# EAGLE design main_stm (EAGLE 9.6.2)
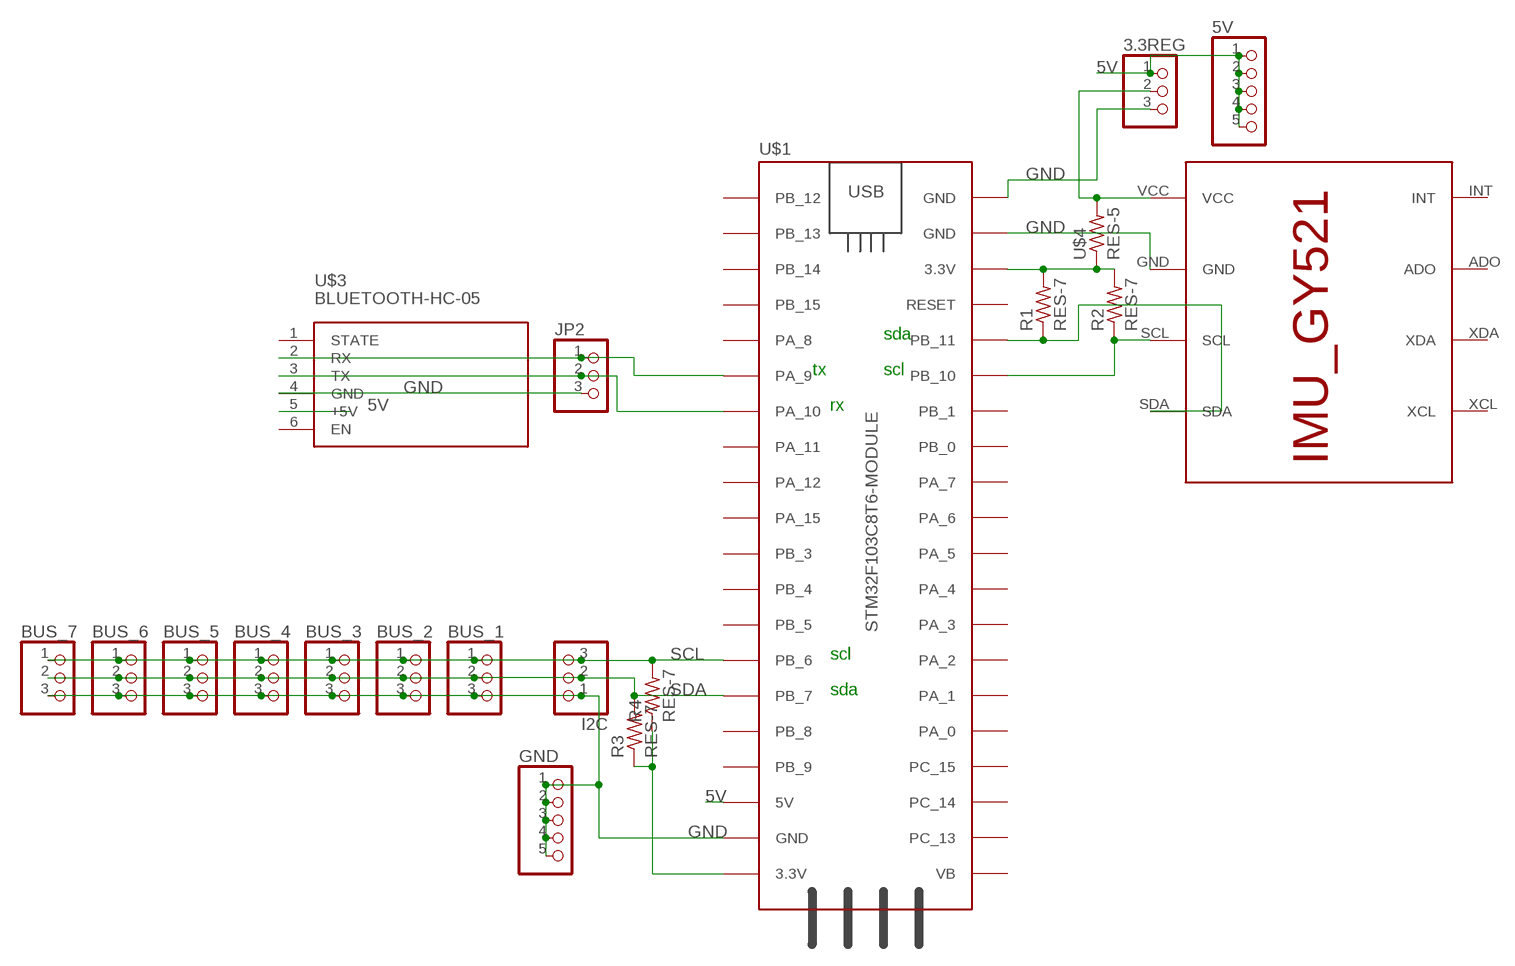
[diagram p0: schematic, sheet 1]

## Parts
3.3REG  PINHD-1X3  [1X03]
5V  PINHD-1X5  [1X05]
BUS_1  PINHD-1X3  [1X03]
BUS_2  PINHD-1X3  [1X03]
BUS_3  PINHD-1X3  [1X03]
BUS_4  PINHD-1X3  [1X03]
BUS_5  PINHD-1X3  [1X03]
BUS_6  PINHD-1X3  [1X03]
BUS_7  PINHD-1X3  [1X03]
GND  PINHD-1X5  [1X05]
I2C  PINHD-1X3  [1X03]
JP2  PINHD-1X3  [1X03]
R1  RES-7  [0204/7]
R2  RES-7  [0204/7]
R3  RES-7  [0204/7]
R4  RES-7  [0204/7]
U$1  STM32F103C8T6-MODULE  [STM32F103C8T6-MODULE]
U$2  IMU_ROBOCON_GY521  [IMU_GY521]
U$3  BLUETOOTH-HC-05  [WIRELESS-BLUETOOTH-HC-05]
U$4  RES-5  [0204/5]

## Nets
5V: 3.3REG.1 5V.1 5V.2 5V.3 5V.4 5V.5 U$1.5V U$3.5(+5V)
GND: 3.3REG.3 BUS_1.3 BUS_2.3 BUS_3.3 BUS_4.3 BUS_5.3 BUS_6.3 BUS_7.3 GND.1 GND.2 GND.3 GND.4 GND.5 I2C.1 JP2.3 U$1.GND_1(GND) U$1.GND_2(GND) U$1.GND_3(GND) U$2.GND U$3.4(GND)
N$1: R1.1 U$1.PB_11 U$2.SDA
N$2: R2.1 U$1.PB_10 U$2.SCL
N$3: R1.2 R2.2 U$1.3.3V_2(3.3V) U$4.1
N$5: 3.3REG.2 U$2.VCC U$4.2
N$8: R3.1 R4.1 U$1.3.3V_1(3.3V)
N$10: JP2.1 U$1.PA_9 U$3.2(RX)
N$12: JP2.2 U$1.PA_10 U$3.3(TX)
SCL: BUS_1.1 BUS_2.1 BUS_3.1 BUS_4.1 BUS_5.1 BUS_6.1 BUS_7.1 I2C.3 R4.2 U$1.PB_6
SDA: BUS_1.2 BUS_2.2 BUS_3.2 BUS_4.2 BUS_5.2 BUS_6.2 BUS_7.2 I2C.2 R3.2 U$1.PB_7
Unconnected: U$1.PA_0 U$1.PA_1 U$1.PA_2 U$1.PA_3 U$1.PA_4 U$1.PA_5 U$1.PA_6 U$1.PA_7 U$1.PA_8 U$1.PA_11 U$1.PA_12 U$1.PA_15 U$1.PB_0 U$1.PB_1 U$1.PB_3 U$1.PB_4 U$1.PB_5 U$1.PB_8 U$1.PB_9 U$1.PB_12 U$1.PB_13 U$1.PB_14 U$1.PB_15 U$1.PC_13 U$1.PC_14 U$1.PC_15 U$1.RESET U$1.VB U$2.ADO U$2.INT U$2.XCL U$2.XDA U$3.1(STATE) U$3.6(EN)

## Notes on the sheet
- sda
- tx | scl
- rx
- scl
- sda

## Library data of the parts
3.3REG BUS_1-BUS_7 I2C JP2 = MIA_LIBRARY-2-2-2:PINHD-1X3: PIN HEADER
5V GND = MIA_LIBRARY-2-2-2:PINHD-1X5: PIN HEADER
R1-R4 = MIA_LIBRARY-2-2-2:RES-7
U$1 = MIA_LIBRARY-2-2-2:STM32F103C8T6-MODULE: STM32F103C8T6 module with ARM Cortex-3, 20kB SRAM, 64kB Flash, 72MHz
U$2 = MIA_LIBRARY-2-2-2:IMU_ROBOCON_GY521
U$3 = MIA_LIBRARY-2-2-2:BLUETOOTH-HC-05: Bluetooth Transceiver Module based on HC-05 board Tutorial is available here: https://arduino-info.wikispaces.com/BlueTooth-HC05-HC06-Modules-How-To Click here to find device on ebay.com <http://www.ebay.com/sch/hc-05+module+rs232>
U$4 = MIA_LIBRARY-2-2-2:RES-5

## Board
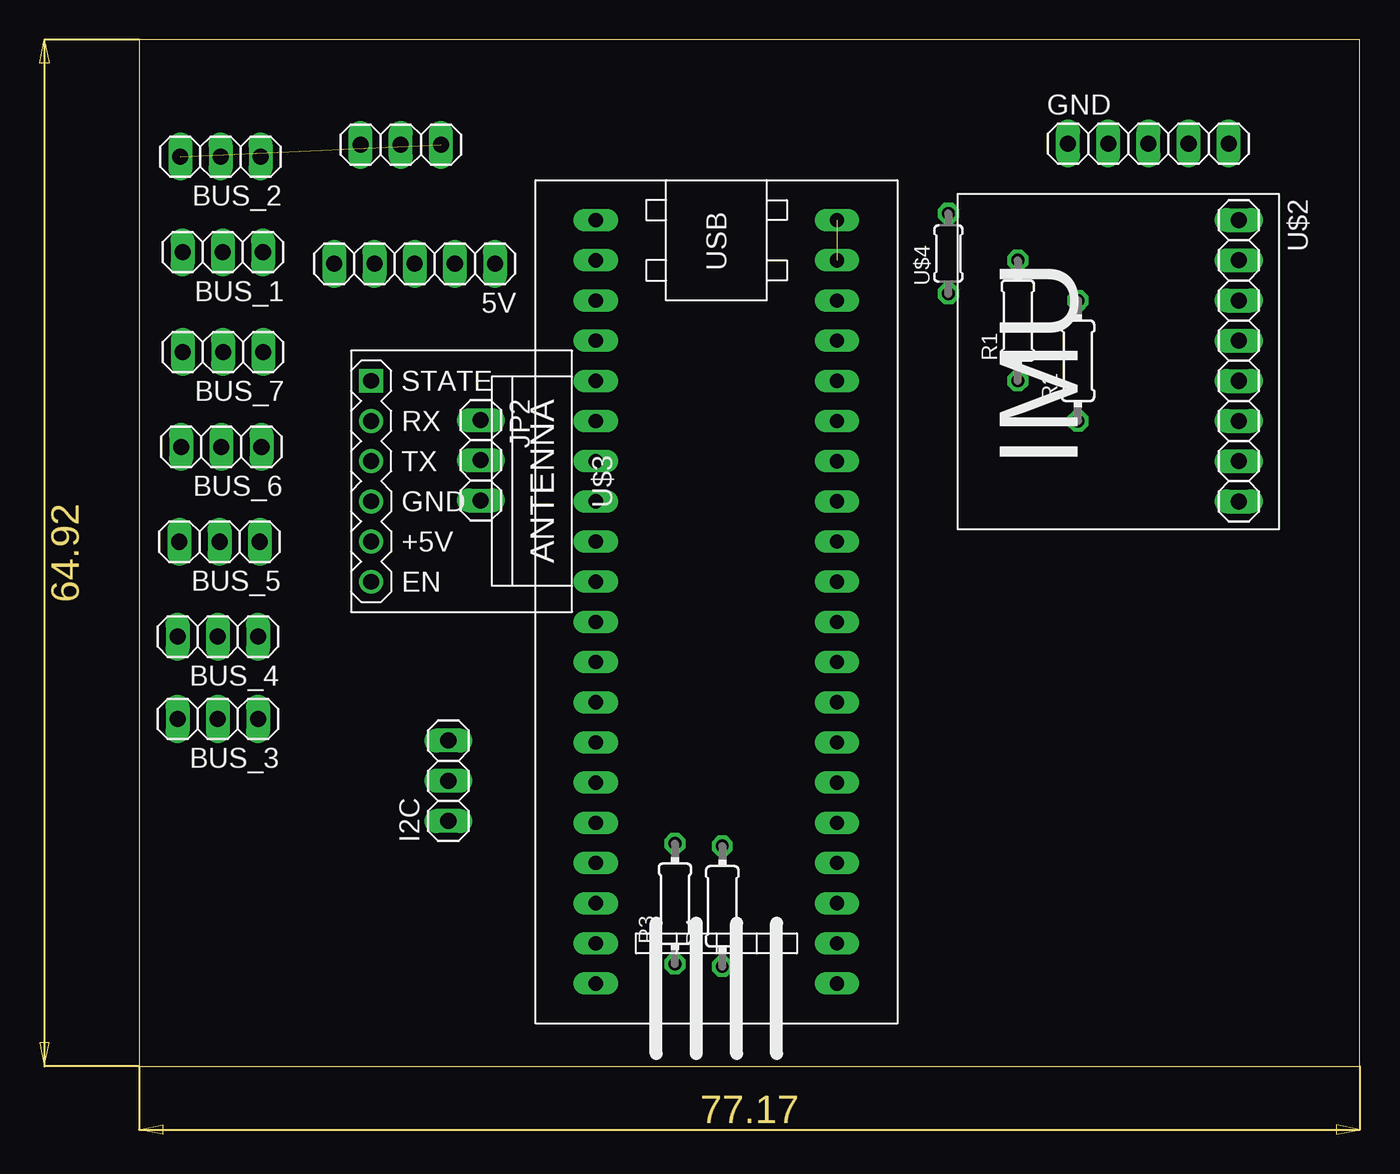
[diagram p1: board, top side]
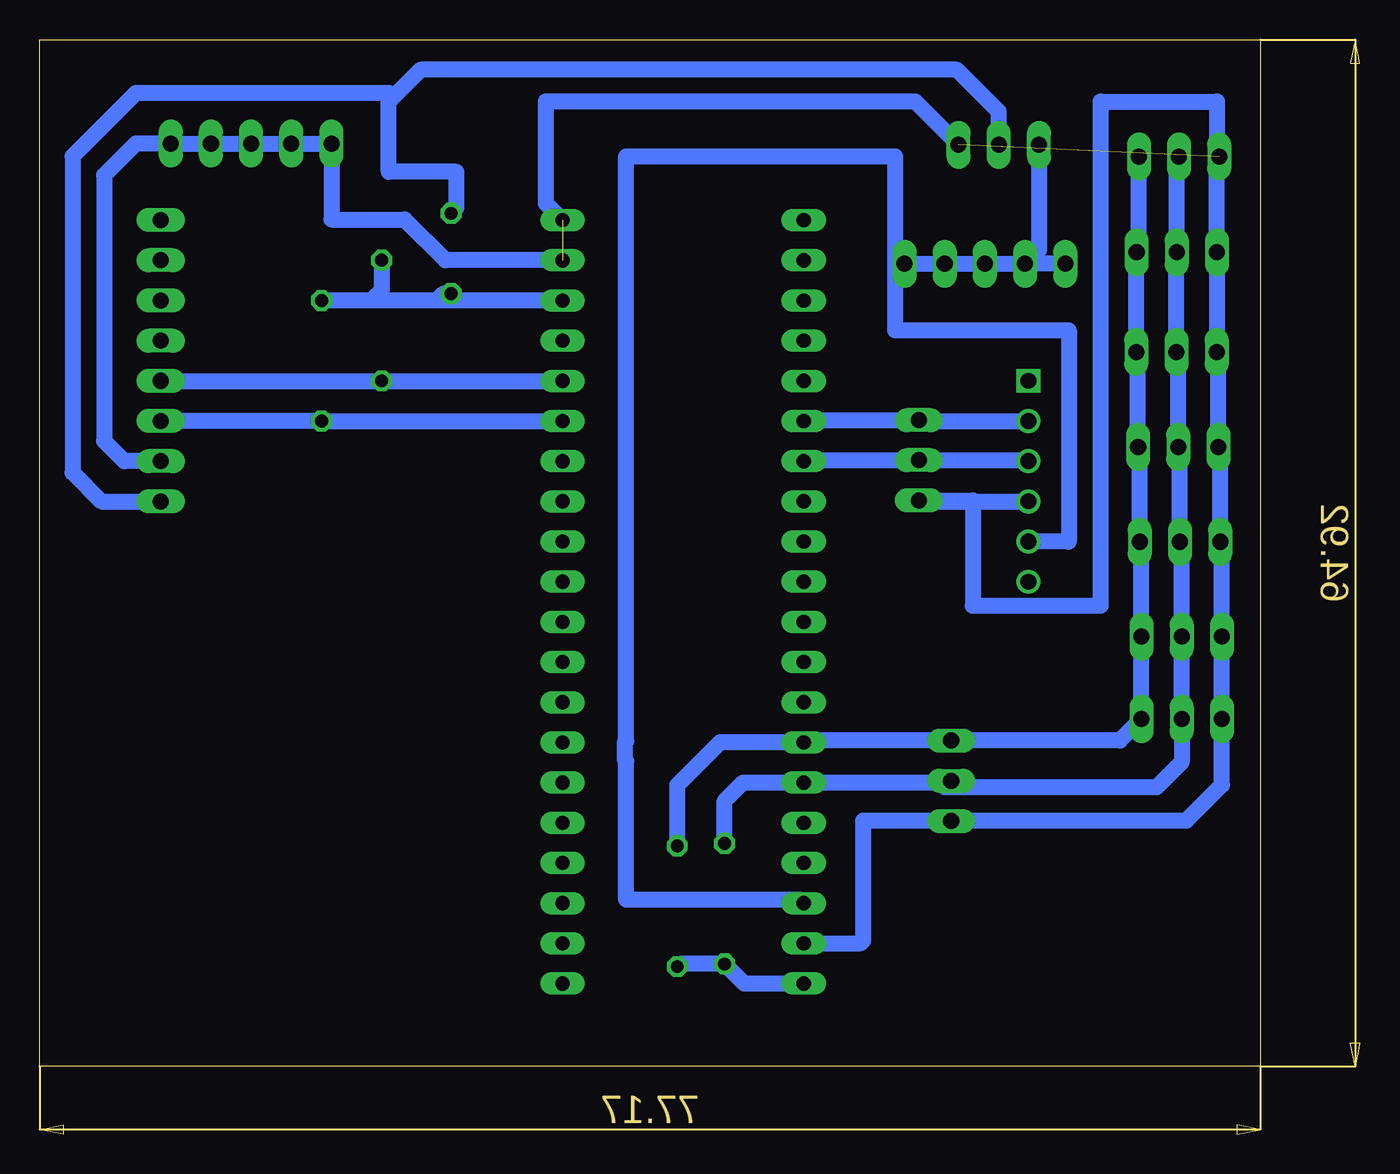
[diagram p2: board, bottom side, seen from below]

Size 77.17 x 64.92 mm. Coordinates in mm from the lower left corner, seen from the top.
Outline: 0,0 77.17,0 77.17,64.92 0,64.92 0,0
Copper layers (1*16): Top 0.035mm / dielectric 1.5mm / Bottom 0.035mm
Design rules "default": minimum track width 6mil, minimum drill 0.35mm, track to track 6mil, track to pad 6mil, pad to pad 6mil, via to via 6mil, smd to smd 6mil, copper to edge 40mil, drill to drill 6mil, minimum pad ring 10mil, minimum via ring 8mil, stop-mask expansion 4mil, vias tented up to drill 0mil, thermal gap 10mil

### Footprints (pad centres in the part's own frame; a part is rotated, then mirrored left to right if it is on the bottom)
1X03 = drill 1.016 long: 1 -2.54,0; 2 0,0; 3 2.54,0
1X05 = drill 1.016 long: 1 -5.08,0; 2 -2.54,0; 3 0,0; 4 2.54,0; 5 5.08,0
0204/7 = drill 0.813 octagon: 1 -3.81,0; 2 3.81,0
STM32F103C8T6-MODULE = drill 0.9 long: 3.3V_1 25.4,-7.62; 3.3V_2 -17.78,7.62; 5V 20.32,-7.62; GND_1 22.86,-7.62; GND_2 -20.32,7.62; GND_3 -22.86,7.62; PA_0 15.24,7.62; PA_1 12.7,7.62; PA_2 10.16,7.62; PA_3 7.62,7.62; PA_4 5.08,7.62; PA_5 2.54,7.62; PA_6 0,7.62; PA_7 -2.54,7.62; PA_8 -12.7,-7.62; PA_9 -10.16,-7.62; PA_10 -7.62,-7.62; PA_11 -5.08,-7.62; PA_12 -2.54,-7.62; PA_15 0,-7.62; PB_0 -5.08,7.62; PB_1 -7.62,7.62; PB_3 2.54,-7.62; PB_4 5.08,-7.62; PB_5 7.62,-7.62; PB_6 10.16,-7.62; PB_7 12.7,-7.62; PB_8 15.24,-7.62; PB_9 17.78,-7.62; PB_10 -10.16,7.62; PB_11 -12.7,7.62; PB_12 -22.86,-7.62; PB_13 -20.32,-7.62; PB_14 -17.78,-7.62; PB_15 -15.24,-7.62; PC_13 22.86,7.62; PC_14 20.32,7.62; PC_15 17.78,7.62; RESET -15.24,7.62; VB 25.4,7.62
IMU_GY521 = drill 1.016 long: ADO -6.35,0; GND 6.35,0; INT -8.89,0; SCL 3.81,0; SDA 1.27,0; VCC 8.89,0; XCL -3.81,0; XDA -1.27,0
WIRELESS-BLUETOOTH-HC-05 = drill 1 square: 1 -6.35,-17.145 | drill 1: 2 -3.81,-17.145; 3 -1.27,-17.145; 4 1.27,-17.145; 5 3.81,-17.145; 6 6.35,-17.145
0204/5 = drill 0.813 octagon: 1 -2.54,0; 2 2.54,0

### Placement (x,y rotation side)
3.3REG  16.54,58.26 0 top
5V  17.41,50.74 180 top
BUS_1  5.28,51.47 180 top
BUS_2  5.14,57.52 180 top
BUS_3  4.97,21.97 180 top
BUS_4  4.97,27.17 180 top
BUS_5  5.08,33.17 180 top
BUS_6  5.19,39.17 180 top
BUS_7  5.3,45.17 180 top
GND  63.8,58.34 0 top
I2C  19.55,18.05 90 top
JP2  21.59,38.32 270 top
R1  55.54,47.15 90 top
R2  59.35,44.61 90 top
R3  33.86,10.28 90 top
R4  36.86,10.12 90 top
U$1  36.49,30.64 270 top
U$2  69.51,44.61 270 top
U$3  31.81,36.99 270 top
U$4  51.15,51.39 90 top

### Tracks (layer width: path | path; a pad name or v marks a point on that pad's centre or on a via)
5V
  Bottom 1: 23.09,50.74 23.09,57.54 40.09,57.54 40.09,20.56 40.17,20.47 40.17,19.39 40.09,19.3 40.09,10.54 29.09,10.54 U$1.5V | 23.09,50.74 23.09,46.54 12.11,46.54 12.11,33.18 U$3.5 | 5V.5 5V.4 | 23.09,50.74 5V.1 5V.2 5V.3 5V.4 | 3.3REG.1 14,51.62 5V.4
GND  (2 unrouted)
  Bottom 1: U$2.GND 71.81,38.26 73.09,39.54 73.09,56.34 71.09,58.34 GND.5 GND.4 GND.3 GND.2 GND.1 58.72,53.54 54.09,53.54 51.51,50.96 U$1.GND_2 | U$3.4 21.53,35.72 JP2.3 18.18,35.78 18.18,29.13 10.08,29.13 10.08,61 2.74,61 2.74,57.37 | U$1.GND_1 25.28,7.78 25.09,7.96 25.09,15.54 19.57,15.54 | 19.57,15.54 I2C.1 | 3.3REG.3 21.82,61 45.17,61 45.17,54.56 U$1.GND_3 | 2.74,57.37 BUS_1.3 2.74,45.72 | 2.74,57.37 BUS_2.3 | 2.74,45.72 2.74,45.18 BUS_7.3 | 2.74,45.72 2.65,45.62 BUS_6.3 2.54,39.06 2.54,33.72 | 2.54,33.72 2.43,33.61 BUS_4.3 BUS_3.3 2.43,17.78 4.67,15.54 19.57,15.54 | BUS_5.3 2.54,33.72
N$1
  Bottom 1: U$1.PB_11 R1.1 U$2.SDA
N$2
  Bottom 1: U$1.PB_10 R2.1 67.83,40.8 U$2.SCL
N$3
  Bottom 1: R1.2 55.54,49.09 56.21,48.42 | 56.21,48.42 R2.2 | U$1.3.3V_2 52.09,48.42 | 52.09,48.42 56.21,48.42 | U$4.1 51.66,48.85 52.09,48.42
N$5
  Bottom 1: U$4.2 50.81,54.27 50.81,56.54 50.84,56.56 55.09,56.56 55.09,61 | U$2.VCC 73.27,35.72 75.09,37.54 75.09,57.54 71.09,61.54 55.09,61.54 55.09,61 | 3.3REG.2 16.54,60.36 19.17,63 53.09,63 55.09,61
N$8
  Bottom 1: R4.1 36.7,6.47 R3.1 32.63,5.24 U$1.3.3V_1
N$10
  Bottom 1: U$3.2 21.53,40.8 JP2.1 28.81,40.86 U$1.PA_9
N$12
  Bottom 1: U$1.PA_10 28.81,38.32 JP2.2 14.67,38.32 U$3.3
SCL
  Bottom 1: R4.2 36.86,17.77 34.15,20.48 U$1.PB_6 28.76,20.59 I2C.3 8.88,20.59 BUS_3.1 BUS_4.1 7.51,33.06 BUS_5.1 7.62,39.06 BUS_6.1 7.73,45.06 BUS_7.1 7.84,51.45 BUS_1.1 7.68,51.61 BUS_2.1
SDA
  Bottom 1: R3.2 33.86,16.77 32.69,17.94 U$1.PB_7 19.66,17.94 | 19.66,17.94 19.94,17.66 6.55,17.66 4.97,19.24 BUS_3.2 BUS_4.2 4.97,33.06 BUS_5.2 5.08,39.17 BUS_6.2 5.19,45.17 BUS_7.2 5.3,51.47 BUS_1.2 5.28,57.37 BUS_2.2 | 19.66,17.94 I2C.2